# EAGLE schematic HeatpumpMonitor (EAGLE 6.5.0)
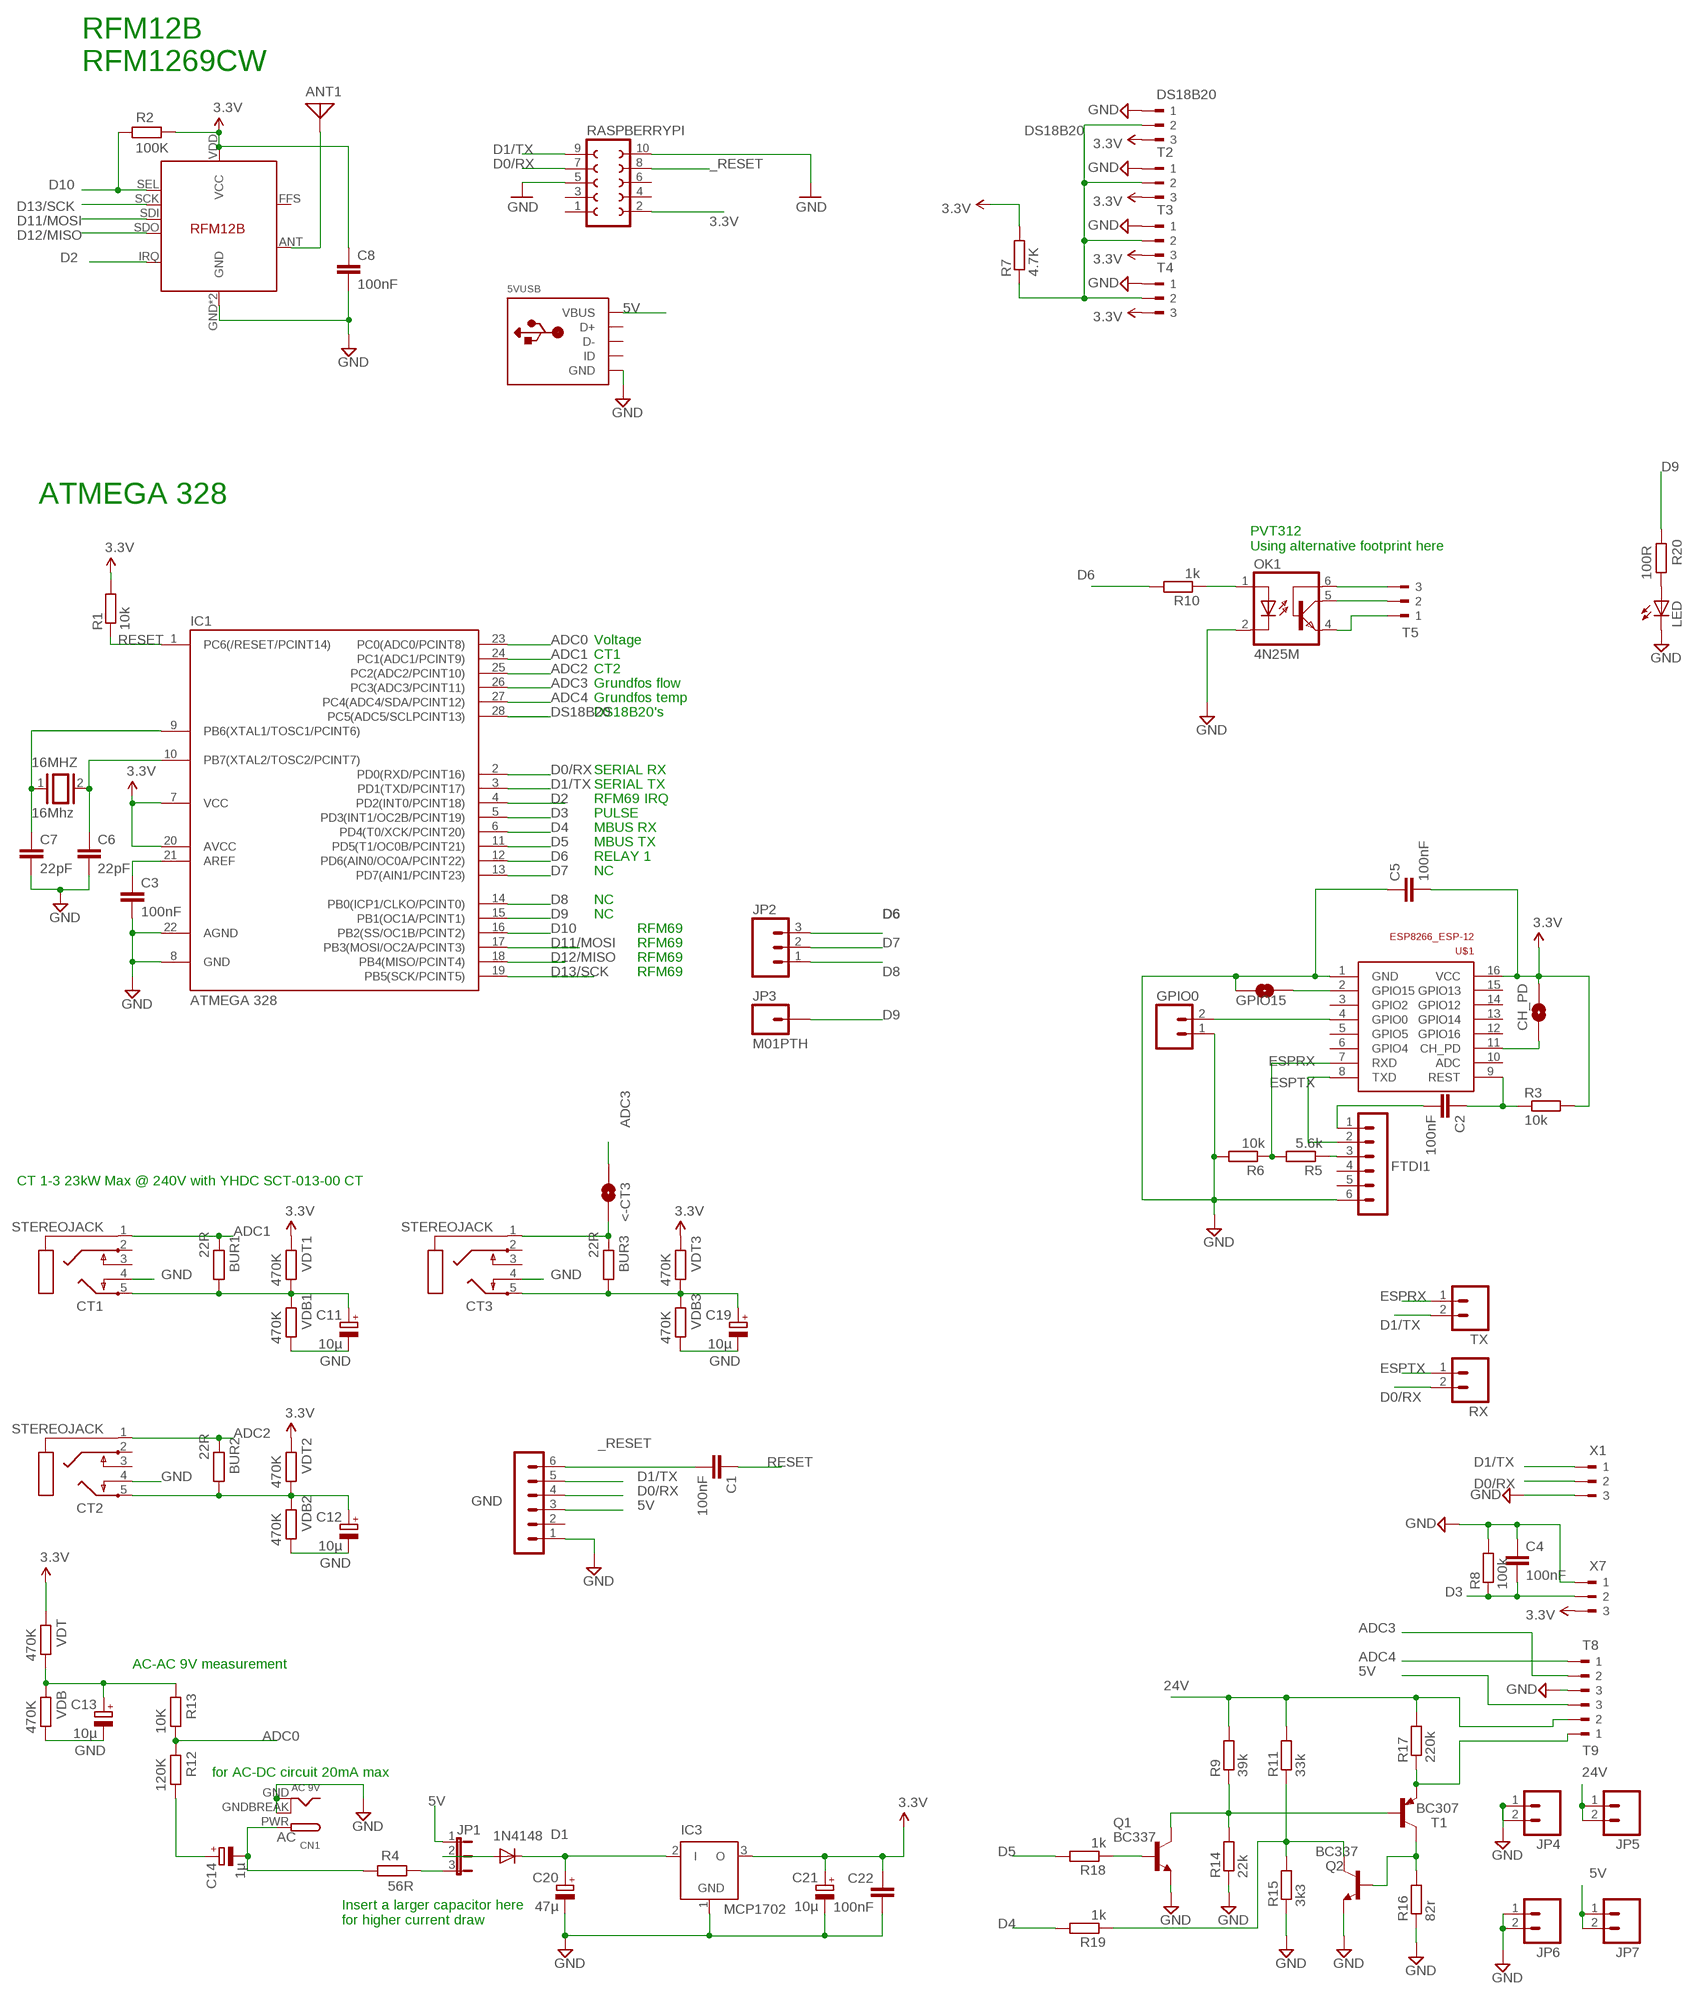
[diagram p0: schematic, sheet 1]

## Parts
5VUSB  USBMOLEX  [USB-MINIB-THM-MOLEX]
16MHZ  16Mhz  XTAL/S  [QS]
<-CT3  SOLDERJUMPERNO  [SJ_2S-NO]
ANT1  ANTENNA  [PAD-01]
BUR1  22R  R-EU_0204/7  [0204/7]
BUR2  22R  R-EU_0204/7  [0204/7]
BUR3  22R  R-EU_0204/7  [0204/7]
C1  100nF  C-EU025-024X044  [C025-024X044]
C2  100nF  C-EU025-024X044  [C025-024X044]
C3  100nF  C-EU025-024X044  [C025-024X044]
C4  100nF  C-EU025-024X044  [C025-024X044]
C5  100nF  C-EU025-024X044  [C025-024X044]
C6  22pF  C2.5/2  [C2.5-2]
C7  22pF  C2.5/2  [C2.5-2]
C8  100nF  C-EU025-024X044  [C025-024X044]
C11  10µ  CPOL-EUE1.8-4  [E1,8-4]
C12  10µ  CPOL-EUE1.8-4  [E1,8-4]
C13  10µ  CPOL-EUE1.8-4  [E1,8-4]
C14  1µ  CPOL-EUE1.8-4  [E1,8-4]
C19  10µ  CPOL-EUE1.8-4  [E1,8-4]
C20  47µ  CPOL-EUE1.8-4  [E1,8-4]
C21  10µ  CPOL-EUE1.8-4  [E1,8-4]
C22  100nF  C-EU025-024X044  [C025-024X044]
CH_PD  SOLDERJUMPERNO  [SJ_2S-NO]
CN1  AC 9V  DCBARRELPTH  [DCJACK_2MM_PTH]
CT1  STEREOJACK  [STX3100]
CT2  STEREOJACK  [STX3100]
CT3  STEREOJACK  [STX3100]
D1  1N4148  DIODE1N4148  [DIODE-1N4148]
DS18B20  180-3  [180-3]
FTDI1  FTDI  MA06-1  [MA06-1]
GND  FTDI  MA06-1  [MA06-1]
GPIO0  M02PTH  [1X02]
GPIO15  SOLDERJUMPERNO  [SJ_2S-NO]
IC1  ATMEGA 328  ATMEGA48/88/168-PU  [DIL28-3]
IC3  MCP1702  MCP1702Z  [TO92]
JP1  JP2E  [JP2]
JP2  M03PTH  [1X03]
JP3  M01PTH  [1X01]
JP4  M02PTH  [1X02]
JP5  M02PTH  [1X02]
JP6  M02PTH  [1X02]
JP7  M02PTH  [1X02]
LED  LED3MM  [LED3MM]
OK1  4N25M  [DIL06]
Q1  BC337  [TO92]
Q2  BC337  [TO92]
R1  10k  R-EU_0204/7  [0204/7]
R2  100K  R-EU_0204/7  [0204/7]
R3  10k  R-EU_0204/7  [0204/7]
R4  56R  R-EU_0204/7  [0204/7]
R5  5.6k  R-EU_0204/7  [0204/7]
R6  10k  R-EU_0204/7  [0204/7]
R7  4.7K  R-EU_0204/7  [0204/7]
R8  100k  R-EU_0207/2V  [0207/2V]
R9  39k  R-EU_0204/7  [0204/7]
R10  1k  R-EU_0204/7  [0204/7]
R11  33k  R-EU_0204/7  [0204/7]
R12  120K  R-EU_0204/7  [0204/7]
R13  10K  R-EU_0204/7  [0204/7]
R14  22k  R-EU_0204/7  [0204/7]
R15  3k3  R-EU_0204/7  [0204/7]
R16  82r  R-EU_0204/7  [0204/7]
R17  220k  R-EU_0204/7  [0204/7]
R18  1k  R-EU_0204/7  [0204/7]
R19  1k  R-EU_0204/7  [0204/7]
R20  100R  R-EU_0204/7  [0204/7]
RASPBERRYPI  FE05-2  [FE05-2]
RX  M02PTH  [1X02]
T1  BC307  [TO92]
T2  180-3  [180-3]
T3  180-3  [180-3]
T4  180-3  [180-3]
T5  180-3  [180-3]
T8  180-3  [180-3]
T9  180-3  [180-3]
TX  M02PTH  [1X02]
U$1  ESP8266_ESP-12  [ESP8266-ESP12]
U$14  RFM12B  [RFM12B]
VDB  470K  R-EU_0204/7  [0204/7]
VDB1  470K  R-EU_0204/7  [0204/7]
VDB2  470K  R-EU_0204/7  [0204/7]
VDB3  470K  R-EU_0204/7  [0204/7]
VDT  470K  R-EU_0204/7  [0204/7]
VDT1  470K  R-EU_0204/7  [0204/7]
VDT2  470K  R-EU_0204/7  [0204/7]
VDT3  470K  R-EU_0204/7  [0204/7]
X1  180-3  [180-3]
X7  180-3  [180-3]

## Nets
3.3V: C5.2 C8.1 C21.+ C22.1 CH_PD.1 DS18B20.3 IC1.7(VCC) IC1.20(AVCC) IC3.3(O) R1.2 R2.1 R3.2 R7.2 RASPBERRYPI.2 T2.3 T3.3 T4.3 U$1.16(VCC) U$14.VDD(VCC) VDT1.2 VDT2.2 VDT3.2 VDT.2 X7.3
5V [power]: 5VUSB.VBUS GND.3 JP1.1 JP7.1 JP7.2 T9.3
24V: JP5.1 JP5.2 R9.2 R11.2 R17.2 T9.2
_RESET: C1.2 GND.6 RASPBERRYPI.8
AC: C14.- CN1.PWR R4.2
ADC0: IC1.23(PC0(ADC0/PCINT8)) R12.2 R13.1
ADC1: BUR1.2 CT1.1 IC1.24(PC1(ADC1/PCINT9))
ADC2: BUR2.2 CT2.1 IC1.25(PC2(ADC2/PCINT10))
ADC3: <-CT3.2 IC1.26(PC3(ADC3/PCINT11)) T8.2
ADC4: IC1.27(PC4(ADC4/SDA/PCINT12)) T8.1
D0/RX: GND.4 IC1.2(PD0(RXD/PCINT16)) RASPBERRYPI.7 RX.2 X1.2
D1/TX: GND.5 IC1.3(PD1(TXD/PCINT17)) RASPBERRYPI.9 TX.2 X1.1
D2: IC1.4(PD2(INT0/PCINT18)) U$14.IRQ
D3: C4.2 IC1.5(PD3(INT1/OC2B/PCINT19)) R8.1 X7.2
D4: IC1.6(PD4(T0/XCK/PCINT20)) R19.2
D5: IC1.11(PD5(T1/OC0B/PCINT21)) R18.2
D6: IC1.12(PD6(AIN0/OC0A/PCINT22)) JP2.3 R10.2
D7: IC1.13(PD7(AIN1/PCINT23)) JP2.2
D8: IC1.14(PB0(ICP1/CLKO/PCINT0)) JP2.1
D9: IC1.15(PB1(OC1A/PCINT1)) JP3.1 R20.2
D10: IC1.16(PB2(SS/OC1B/PCINT2)) R2.2 U$14.SEL
D11/MOSI: IC1.17(PB3(MOSI/OC2A/PCINT3)) U$14.SDI
D12/MISO: IC1.18(PB4(MISO/PCINT4)) U$14.SDO
D13/SCK: IC1.19(PB5(SCK/PCINT5)) U$14.SCK
DIG1: ANT1.1 U$14.ANT
DS18B20: DS18B20.2 IC1.28(PC5(ADC5/SCLPCINT13)) R7.1 T2.2 T3.2 T4.2
ESPRX: R5.2 R6.1 TX.1 U$1.7(RXD)
ESPTX: FTDI1.2 RX.1 U$1.8(TXD)
GND [power]: 5VUSB.GND C3.2 C4.1 C5.1 C6.2 C7.2 C8.2 C11.- C12.- C13.- C19.- C20.- C21.- C22.2 CN1.GND CN1.GNDBREAK CT1.4 CT2.4 CT3.4 DS18B20.1 FTDI1.6 GND.1 GPIO0.1 GPIO15.2 IC1.8(GND) IC1.22(AGND) IC3.1(GND) JP4.1 JP4.2 JP6.1 JP6.2 LED.K(C) OK1.2(C) Q1.1(E) Q2.1(E) R6.2 R8.2 R14.1 R15.1 R16.1 RASPBERRYPI.5 RASPBERRYPI.10 T2.1 T3.1 T4.1 T8.3 U$1.1(GND) U$14.GND U$14.P$12(GND) VDB1.1 VDB2.1 VDB3.1 VDB.1 X1.3 X7.1
N$1: 16MHZ.2 C6.1 IC1.10(PB7(XTAL2/TOSC2/PCINT7))
N$2: BUR2.1 C12.+ CT2.5 VDB2.2 VDT2.1
N$3: C2.2 FTDI1.1
N$4: <-CT3.1 BUR3.2 CT3.1
N$5: OK1.1(A) R10.1
N$6: OK1.6(BAS) T5.3
N$7: C14.+ R12.1
N$8: BUR3.1 C19.+ CT3.5 VDB3.2 VDT3.1
N$9: OK1.5(COL) T5.2
N$10: OK1.4(EMI) T5.1
N$11: C20.+ D1.C IC3.2(I)
N$12: 16MHZ.1 C7.1 IC1.9(PB6(XTAL1/TOSC1/PCINT6))
N$13: R17.1 T1.1(E) T9.1
N$14: JP1.3 R4.1
N$15: LED.A R20.1
N$16: Q2.2(B) R16.2 T1.3(C)
N$18: Q1.3(C) R9.1 R14.2 T1.2(B)
N$19: C3.1 IC1.21(AREF)
N$21: Q2.3(C) R11.1 R15.2 R19.1
N$24: D1.A JP1.2
N$25: Q1.2(B) R18.1
N$26: GPIO15.1 U$1.2(GPIO15)
N$29: GPIO0.2 U$1.4(GPIO0)
N$34: C13.+ R13.2 VDB.2 VDT.1
N$36: FTDI1.3 R5.1
N$38: BUR1.1 C11.+ CT1.5 VDB1.2 VDT1.1
N$39: CH_PD.2 U$1.11(CH_PD)
N$40: C2.1 R3.1 U$1.9(REST)
RESET: C1.1 IC1.1(PC6(/RESET/PCINT14)) R1.1
Unconnected: 5VUSB.D+ 5VUSB.D- 5VUSB.ID CT1.2 CT1.3 CT2.2 CT2.3 CT3.2 CT3.3 FTDI1.4 FTDI1.5 GND.2 RASPBERRYPI.1 RASPBERRYPI.3 RASPBERRYPI.4 RASPBERRYPI.6 U$1.3(GPIO2) U$1.5(GPIO5) U$1.6(GPIO4) U$1.10(ADC) U$1.12(GPIO16) U$1.13(GPIO14) U$1.14(GPIO12) U$1.15(GPIO13) U$14.FFS

## Notes on the sheet
- RFM12B
  RFM1269CW
- ATMEGA 328
- PVT312
  Using alternative footprint here
- Voltage
- CT1
- CT2
- Grundfos flow
- Grundfos temp
- DS18B20's
- SERIAL RX
- SERIAL TX
- RFM69 IRQ
- PULSE
- MBUS RX
- MBUS TX
- RELAY 1
- NC
- NC
- NC
- RFM69
- RFM69
- RFM69
- RFM69
- CT 1-3 23kW Max @ 240V with YHDC SCT-013-00 CT
- AC-AC 9V measurement
- for AC-DC circuit 20mA max
- Insert a larger capacitor here
  for higher current draw

## Library data of the parts
5VUSB = adafruit:USB: USB Connectors USBMINIB - Surface Mount Female Mini-B USB Connector 4UConnector: 06564 By microbuilder.eu Thru-hole RA Female Mini-B USB Connector 4UConnector: 18732 By ladyada.net
16MHZ = special:XTAL/S: CRYSTAL
<-CT3 CH_PD GPIO15 = SparkFun:SOLDERJUMPER: Solder Jumper Standard SMD solder jumper. Used to automate production. Two varients : Normally Open and Normally Closed are the same, but have different paste layers. NC will have a large amount of paste and should jumper during reflow.
ANT1 = discrete:ANTENNA: Antenna
BUR1-BUR3 R2-R6 R8 R10 R12 R13 R20 VDB VDB1-VDB3 VDT VDT1-VDT3 = rcl:R-EU_: RESISTOR, European symbol
C1-C5 C8 C22 = resistor:C-EU: CAPACITOR, European symbol
C6 C7 = capacitor-wima:C: CAPACITOR naming: grid - package width
C11-C14 C19-C21 = resistor:CPOL-EU: POLARIZED CAPACITOR, European symbol
CN1 = adafruit:DCBARREL: 2.0mm DC Barrel Jack DCJACK_2MM_PTH - Through Hole Jack (4UConnector: 05537)
CT1-CT3 = adafruit:STEREOJACK: MIC/HEADPHONE JACK Stereo jack with two switches. Kycon STX3100, CUI SJ1-3555NG and/or 4UCon 05544
D1 = SparkFun:DIODE: Diode These are standard reverse protection diodes and small signal diodes. SMA package can handle up to about 1A. SOD-323 can handle about 200mA. What the SOD-323 package when ordering, there are some mfgs out there that are 5-pin packages.
DS18B20 T2-T5 T8 T9 X1 X7 = con-weidmueller-sl35:180-3: WEIDMUELLER CLAMP CONNECTOR; OC_FARNELL: unknown; OC_NEWARK: unknown
FTDI1 GND = JeeLabs:MA06-1: PIN HEADER
GPIO0 JP4-JP7 RX TX = SparkFun:M02: Header 2 Standard 2-pin 0.1" header. Use with straight break away headers (SKU : PRT-00116), right angle break away headers (PRT-00553), swiss pins (PRT-00743), machine pins (PRT-00117), and female headers (PRT-00115). Molex polarized connector foot print use with SKU : PRT-08233 with associated crimp pins and housings.
IC1 = atmega8:ATMEGA48/88/168-PU
IC3 = JeeLabs:MCP1702: 200 mA, Low Power Low Dropout Voltage Regulator
JP1 = jumper:JP2E: JUMPER
JP2 = SparkFun:M03: Header 3 Standard 3-pin 0.1" header. Use with straight break away headers (SKU : PRT-00116), right angle break away headers (PRT-00553), swiss pins (PRT-00743), machine pins (PRT-00117), and female headers (PRT-00115). Molex polarized connector foot print use with SKU : PRT-08232 with associated crimp pins and housings.
JP3 = SparkFun:M01: Header 1 Standard 1-pin 0.1" header. Use with straight break away headers (SKU : PRT-00116), right angle break away headers (PRT-00553), swiss pins (PRT-00743), machine pins (PRT-00117), and female headers (PRT-00115).
LED = adafruit:LED: LED OSRAM: - CHIPLED LG R971, LG N971, LY N971, LG Q971, LY Q971, LO R971, LY R971 LH N974, LH R974 LS Q976, LO Q976, LY Q976 LO Q996 - Hyper CHIPLED LW Q18S LB Q993, LB Q99A, LB R99A - SideLED LS A670, LO A670, LY A670, LG A670, LP A670 LB A673, LV A673, LT A673, LW A673 LH A674 LY A675 LS A676, LA A676, LO A676, LY A676, LW A676 LS A679, LY A679, LG A679 - Hyper Micro SIDELED® LS Y876, LA Y876, LO Y876, LY Y876 LT Y87S - SmartLED LW L88C, LW L88S LB L89C, LB L89S, LG L890 LS L89K, LO L89K, LY L89K LS L896, LA L896, LO L896, LY L896 - TOPLED LS T670, LO T670, LY T670, LG T670, LP T670 LSG T670, LSP T670, LSY T670, LOP T670, LYG T670 LG T671, LOG T671, LSG T671 LB T673, LV T673, LT T673, LW T673 LH T674 LS T676, LA T676, LO T676, LY T676, LB T676, LH T676, LSB T676, LW T676 LB T67C, LV T67C, LT T67C, LS T67K, LO T67K, LY T67K, LW E67C LS E67B, LA E67B, LO E67B, LY E67B, LB E67C, LV E67C, LT E67C LW T67C LS T679, LY T679, LG T679 LS T770, LO T770, LY T770, LG T770, LP T770 LB T773, LV T773, LT T773, LW T773 LH T774 LS E675, LA E675, LY E675, LS T675 LS T776, LA T776, LO T776, LY T776, LB T776 LHGB T686 LT T68C, LB T68C - Hyper Mini TOPLED® LB M676 - Mini TOPLED Santana® LG M470 LS M47K, LO M47K, LY M47K Source: http://www.osram.convergy.de/
OK1 = optocoupler:4N*?M: General Purpose 6-Pin Phototransistor Optocouplers Source: http://www.fairchildsemi.com/ds/4N/4N35-M.pdf; MPN: 4N25-M; OC_FARNELL: 1021349; OC_NEWARK: 98K9084
Q1 Q2 = transistor:BC337: NPN TRANSISTOR
R1 R7 R9 R11 R14-R19 = resistor:R-EU_: RESISTOR, European symbol
RASPBERRYPI = con-lsta:FE05-2: FEMALE HEADER; OC_FARNELL: unknown; OC_NEWARK: unknown
T1 = transistor-pnp:BC307: PNP Transistor
U$1 = ESP8266-ESP12:ESP8266_ESP-12
U$14 = JeeParts:RFM12B

## Net classes
0 default: width 0.203 mm, drill 0.6 mm, clearance 0.203 mm
1 power: width 0.381 mm, drill 0.6 mm, clearance 0.254 mm
2 gnd: width 0.254 mm, drill 0.6 mm, clearance 0.254 mm